# EAGLE schematic 40-auxiliary-octopus-cable (EAGLE 6.6.0)
AUTHOR: Sean Leavey; COMPANY: Institute for Gravitational Research; DATE: 2015-01-19; DESCRIPTION: 1 x DB50 to 7 x DB9; INFOSETTINGS: Used by 'info.ulp' - do not edit manually! |FileTime=2015-02-02, 13:18:38|FileVersion=2||[LabelBox]|Company=Institute for Gravitational Research|Title=DB9 CABLE|Description=DB9 Cable Male-Female|Revision=2015-02-02|Date=2015-02-02|Author=S. Steinlechner|RevisionDate1=|RevisionAuthor1=|RevisionDate2=|RevisionAuthor2=|RevisionDate3=|RevisionAuthor3=|RevisionDate4=|RevisionAuthor4=|RevisionDate5=|RevisionAuthor5=||[FrontMatter]|DocTitle=|SubTitle=|Authors=|Keywords=|Abstract=|LaTeXSyntax=0||[Safety]|VoltageHazard=-1|HeatHazard=-1|Convection=0|ForcedAir=0|WaterCooling=0|LightHazard=-1|LaserPower=1000|LaserWavelength=1064|LaserClass=6|LightPower=1000|LightInvisible=0||[Notes]|Machinery=-1|IntendedUsers=-1|DisplayHints=1|; REVISIONAUTHOR1: Sean Leavey; REVISIONAUTHOR2: Sean Leavey; REVISIONDATE1: 2015-09-18; REVISIONDATE2: 2016-04-06; TITLE: Aux Octopus Cable
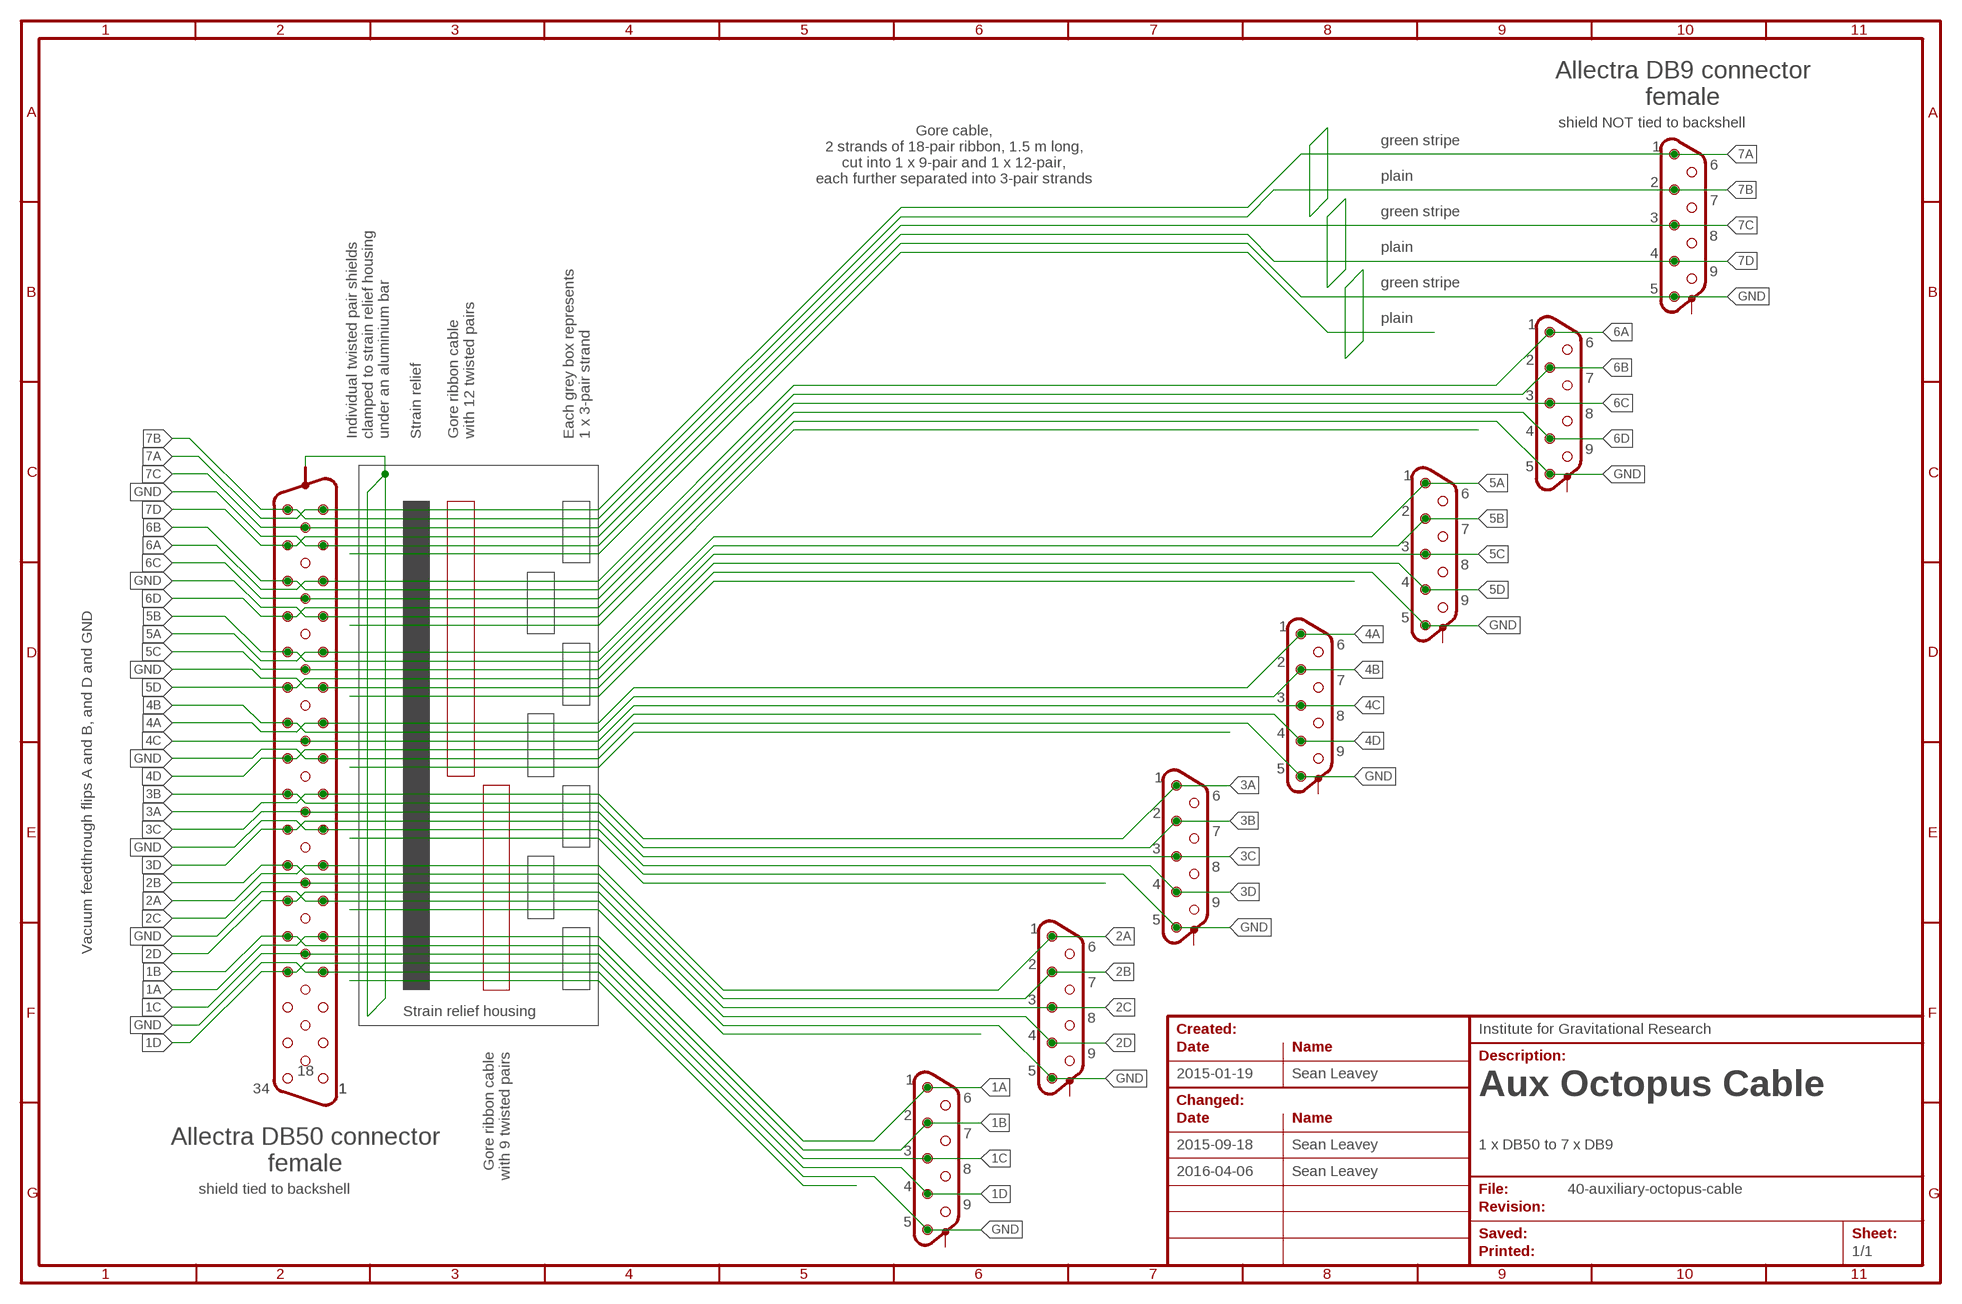
[diagram p0: schematic, sheet 1]
$1 (FRAME-A4-LANDSCAPE): SPICE: <ignore>

## Parts
U$7  XDSUB50-SHIELD  [DUMMY50]
X43  XDSUB9-SHIELD  [DUMMY10]
X44  XDSUB9-SHIELD  [DUMMY10]
X45  XDSUB9-SHIELD  [DUMMY10]
X46  XDSUB9-SHIELD  [DUMMY10]
X47  XDSUB9-SHIELD  [DUMMY10]
X53  XDSUB9-SHIELD  [DUMMY10]
X54  XDSUB9-SHIELD  [DUMMY10]

## Nets
1A: U$7.5 X54.1
1B: U$7.38 X54.2
1C: U$7.21 X54.3
1D: U$7.37 X54.4
2A: U$7.7 X53.1
2B: U$7.40 X53.2
2C: U$7.23 X53.3
2D: U$7.39 X53.4
3A: U$7.9 X47.1
3B: U$7.42 X47.2
3C: U$7.25 X47.3
3D: U$7.41 X47.4
4A: U$7.11 X46.1
4B: U$7.44 X46.2
4C: U$7.27 X46.3
4D: U$7.43 X46.4
5A: U$7.13 X45.1
5B: U$7.46 X45.2
5C: U$7.29 X45.3
5D: U$7.45 X45.4
6A: U$7.15 X44.1
6B: U$7.48 X44.2
6C: U$7.31 X44.3
6D: U$7.47 X44.4
7A: U$7.17 X43.1
7B: U$7.50 X43.2
7C: U$7.33 X43.3
7D: U$7.49 X43.4
GND: U$7.4 U$7.6 U$7.8 U$7.10 U$7.12 U$7.14 U$7.16 X43.5 X44.5 X45.5 X46.5 X47.5 X53.5 X54.5
Unconnected: U$7.1 U$7.2 U$7.3 U$7.18 U$7.19 U$7.20 U$7.22 U$7.24 U$7.26 U$7.28 U$7.30 U$7.32 U$7.34 U$7.35 U$7.36 U$7.51(S) X43.6 X43.7 X43.8 X43.9 X43.10(S) X44.6 X44.7 X44.8 X44.9 X44.10(S) X45.6 X45.7 X45.8 X45.9 X45.10(S) X46.6 X46.7 X46.8 X46.9 X46.10(S) X47.6 X47.7 X47.8 X47.9 X47.10(S) X53.6 X53.7 X53.8 X53.9 X53.10(S) X54.6 X54.7 X54.8 X54.9 X54.10(S)

## Notes on the sheet
- Allectra DB9 connector
  female
- shield NOT tied to backshell
- green stripe
- Gore cable,
  2 strands of 18-pair ribbon, 1.5 m long,
  cut into 1 x 9-pair and 1 x 12-pair,
  each further separated into 3-pair strands
- plain
- green stripe
- plain
- green stripe
- plain
- Individual twisted pair shields
  clamped to strain relief housing
  under an aluminium bar
- Strain relief
- Gore ribbon cable
  with 12 twisted pairs
- Each grey box represents
  1 x 3-pair strand
- Vacuum feedthrough flips A and B, and D and GND
- Strain relief housing
- Gore ribbon cable
  with 9 twisted pairs
- Allectra DB50 connector
  female
- shield tied to backshell

## Library data of the parts
U$7 = symbols:XDSUB50-SHIELD: D-Sub connector, 50 pins, with shield; SPICE: <ignore>
X43-X47 X53 X54 = symbols:XDSUB9-SHIELD: D-Sub connector, 9 pins, with shield; SPICE: <ignore>